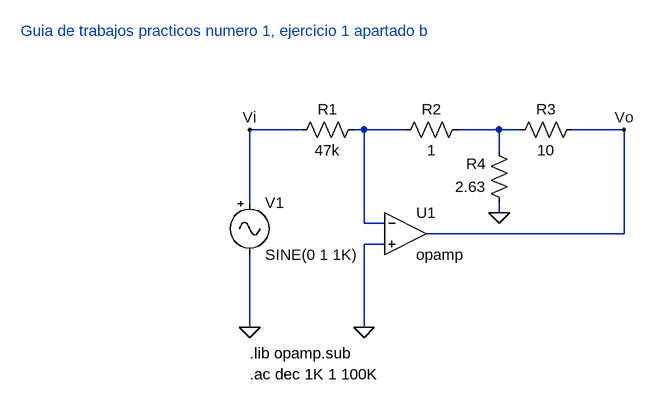
[diagram p0: schematic tp_1_1_b.asc]
tp_1_1_b.asc, the LTspice schematic file:
Version 4
SHEET 1 880 680
WIRE 96 224 16 224
WIRE 192 224 176 224
WIRE 256 224 192 224
WIRE 400 224 336 224
WIRE 432 224 400 224
WIRE 592 224 512 224
WIRE 400 256 400 224
WIRE 16 336 16 224
WIRE 400 352 400 336
WIRE 192 368 192 224
WIRE 224 368 192 368
WIRE 592 384 592 224
WIRE 592 384 288 384
WIRE 224 400 192 400
WIRE 16 528 16 416
WIRE 192 528 192 400
FLAG 192 528 0
FLAG 16 528 0
FLAG 592 224 Vo
FLAG 16 224 Vi
FLAG 400 352 0
SYMBOL res 192 208 R90
WINDOW 0 0 56 VBottom 2
WINDOW 3 32 56 VTop 2
SYMATTR InstName R1
SYMATTR Value 47k
SYMBOL Opamps/opamp 256 320 R0
SYMATTR InstName U1
SYMBOL Misc/signal 16 320 R0
SYMATTR InstName V1
SYMATTR Value2 AC 1
SYMBOL res 352 208 R90
WINDOW 0 0 56 VBottom 2
WINDOW 3 32 56 VTop 2
SYMATTR InstName R2
SYMATTR Value 1
SYMBOL res 528 208 R90
WINDOW 0 0 56 VBottom 2
WINDOW 3 32 56 VTop 2
SYMATTR InstName R3
SYMATTR Value 10
SYMBOL res 416 352 R180
WINDOW 0 36 76 Left 2
WINDOW 3 36 40 Left 2
SYMATTR InstName R4
SYMATTR Value 2.63
TEXT 16 568 Left 2 !.lib opamp.sub
TEXT 16 600 Left 2 !.ac dec 1K 1 100K
TEXT -336 72 Left 2 ;Guia de trabajos practicos numero 1, ejercicio 1 apartado b

The netlist it stands for:
* tp_1_1_b.asc
R1 N001 Vi 47k
XU1 N001 0 Vo opamp Aol=100K GBW=10Meg  ; pins invin noninvin out
V1 Vi 0 SINE(0 1 1K) AC 1
R2 N002 N001 1
R3 Vo N002 10
R4 0 N002 2.63
.lib opamp.sub
.ac dec 1K 1 100K
* Guia de trabajos practicos numero 1, ejercicio 1 apartado b
.backanno
.end